# EAGLE design VNH2SP30_dual (EAGLE 7.2.0)
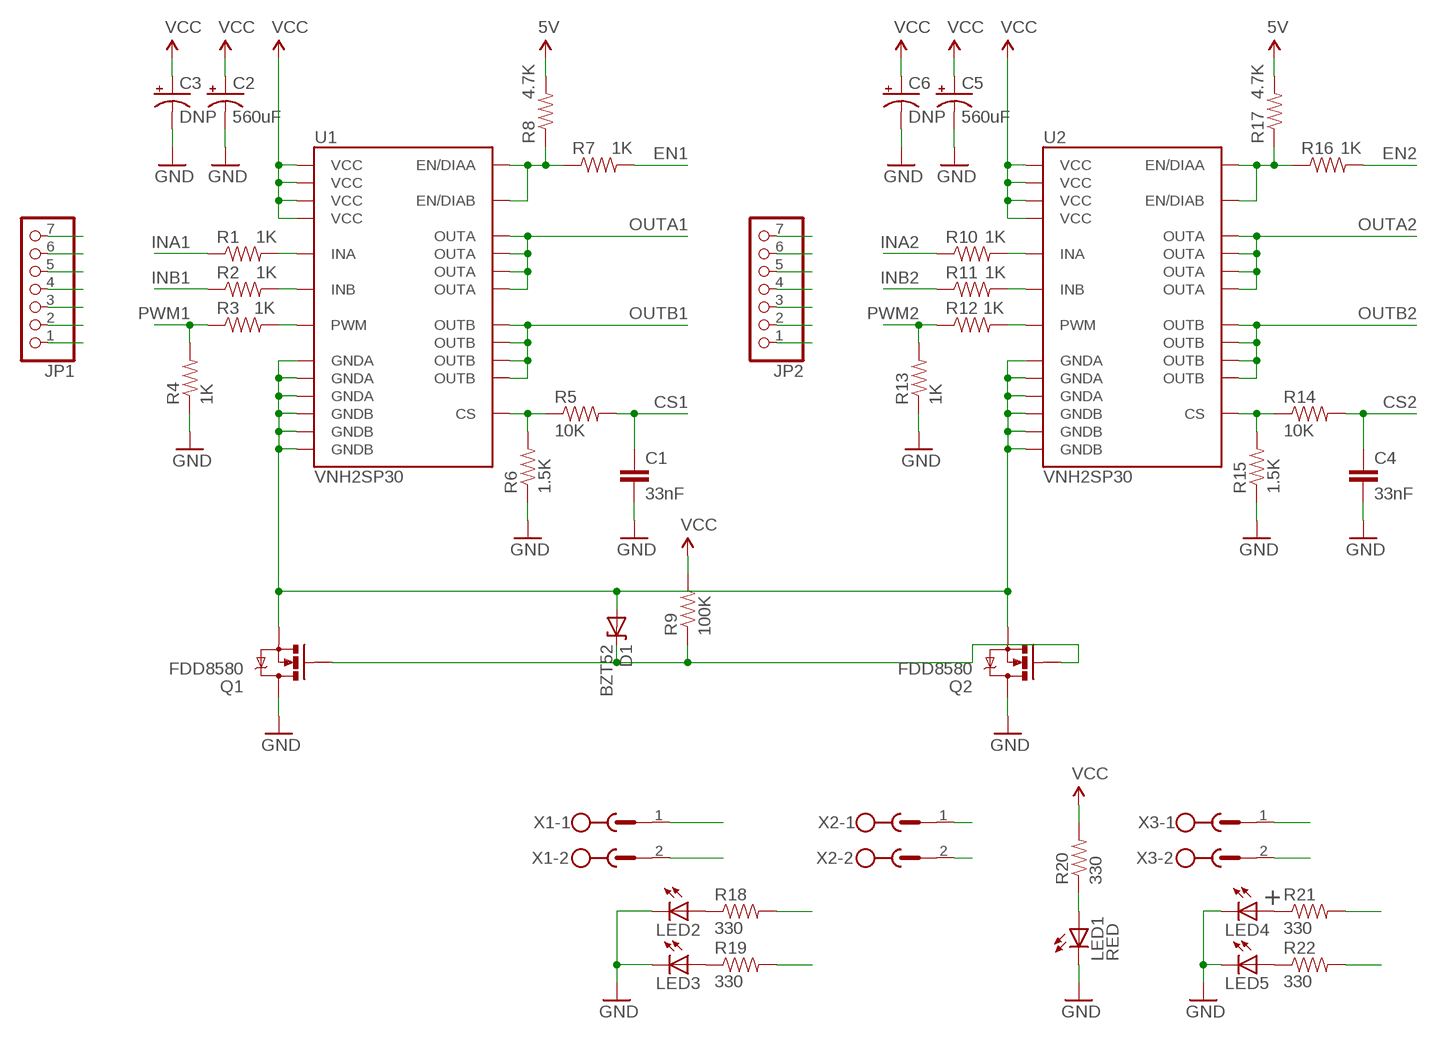
[diagram p0: schematic, sheet 1]

## Parts
C1  33nF  CAP1206  [1206]
C2  560uF  CAP_POLG  [PANASONIC_G]
C3  DNP  CAP_POLPTH4  [CPOL-RADIAL-1000UF-25V]
C4  33nF  CAP1206  [1206]
C5  560uF  CAP_POLG  [PANASONIC_G]
C6  DNP  CAP_POLPTH4  [CPOL-RADIAL-1000UF-25V]
D1  BZT52  DIODE-ZENERSMB  [SMB-DIODE]
JP1  PINHD-1X7  [1X07]
JP2  PINHD-1X7  [1X07]
LED1  RED  LEDCHIPLED_1206  [CHIPLED_1206]
LED2  GREEN  LEDCHIPLED_1206  [CHIPLED_1206]
LED3  GREEN  LEDCHIPLED_1206  [CHIPLED_1206]
LED4  GREEN  LEDCHIPLED_1206  [CHIPLED_1206]
LED5  GREEN  LEDCHIPLED_1206  [CHIPLED_1206]
Q1  FDD8580  MOSFET-NCHANNELFDD8580  [DPAK]
Q2  FDD8580  MOSFET-NCHANNELFDD8580  [DPAK]
R1  1K  RESISTOR1206  [1206]
R2  1K  RESISTOR1206  [1206]
R3  1K  RESISTOR1206  [1206]
R4  1K  RESISTOR1206  [1206]
R5  10K  RESISTOR1206  [1206]
R6  1.5K  RESISTOR1206  [1206]
R7  1K  RESISTOR1206  [1206]
R8  4.7K  RESISTOR1206  [1206]
R9  100K  RESISTOR1206  [1206]
R10  1K  RESISTOR1206  [1206]
R11  1K  RESISTOR1206  [1206]
R12  1K  RESISTOR1206  [1206]
R13  1K  RESISTOR1206  [1206]
R14  10K  RESISTOR1206  [1206]
R15  1.5K  RESISTOR1206  [1206]
R16  1K  RESISTOR1206  [1206]
R17  4.7K  RESISTOR1206  [1206]
R18  330  RESISTOR1206  [1206]
R19  330  RESISTOR1206  [1206]
R20  330  RESISTOR1206  [1206]
R21  330  RESISTOR1206  [1206]
R22  330  RESISTOR1206  [1206]
U1  VNH2SP30  [VNH2SP30]
U2  VNH2SP30  [VNH2SP30]
X1  MSTBV2  [MSTBV2]
X2  MSTBV2  [MSTBV2]
X3  MSTBV2  [MSTBV2]

## Nets
5V: JP1.7 JP2.7 R8.2 R17.2
CS1: C1.1 JP1.2 R5.2
CS2: C4.1 JP2.2 R14.2
EN1: JP1.6 R7.2
EN2: JP2.6 R16.2
GND: C1.2 C2.- C3.2(-) C4.2 C5.- C6.2(-) JP1.1 JP2.1 LED1.C LED2.C LED3.C LED4.C LED5.C Q1.4(D) Q2.4(D) R4.1 R6.1 R13.1 R15.1 X2.1
INA1: JP1.5 R1.1
INA2: JP2.5 R10.1
INB1: JP1.4 R2.1
INB2: JP2.4 R11.1
N$1: R2.2 U1.11(INB)
N$2: R1.2 U1.5(INA)
N$3: R11.2 U2.11(INB)
N$4: R10.2 U2.5(INA)
N$5: R3.2 U1.8(PWM)
N$6: R12.2 U2.8(PWM)
N$7: R5.1 R6.2 U1.9(CS)
N$8: R14.1 R15.2 U2.9(CS)
N$9: R16.1 R17.1 U2.6(EN/DIAA) U2.10(EN/DIAB)
N$10: D1.A Q1.3(S) Q2.3(S) U1.18(GNDB) U1.19(GNDB) U1.20(GNDB) U1.26(GNDA) U1.27(GNDA) U1.28(GNDA) U2.18(GNDB) U2.19(GNDB) U2.20(GNDB) U2.26(GNDA) U2.27(GNDA) U2.28(GNDA)
N$12: R7.1 R8.1 U1.6(EN/DIAA) U1.10(EN/DIAB)
N$13: D1.C Q1.1(G) Q2.1(G) R9.1
N$18: LED1.A R20.1
N$26: LED2.A R18.1
N$27: LED3.A R19.1
N$28: LED4.A R21.1
N$29: LED5.A R22.1
OUTA1: R18.2 U1.1(OUTA) U1.25(OUTA) U1.30(OUTA) U1.SLUG3(OUTA) X1.1
OUTA2: R22.2 U2.1(OUTA) U2.25(OUTA) U2.30(OUTA) U2.SLUG3(OUTA) X3.1
OUTB1: R19.2 U1.15(OUTB) U1.16(OUTB) U1.21(OUTB) U1.SLUG2(OUTB) X1.2
OUTB2: R21.2 U2.15(OUTB) U2.16(OUTB) U2.21(OUTB) U2.SLUG2(OUTB) X3.2
PWM1: JP1.3 R3.1 R4.2
PWM2: JP2.3 R12.1 R13.2
VCC: C2.+ C3.1(+) C5.+ C6.1(+) R9.2 R20.2 U1.3(VCC) U1.13(VCC) U1.23(VCC) U1.SLUG1(VCC) U2.3(VCC) U2.13(VCC) U2.23(VCC) U2.SLUG1(VCC) X2.2

## Notes on the sheet
- +

## Library data of the parts
C1 C4 = SparkFun:CAP: Capacitor Standard 0603 ceramic capacitor, and 0.1" leaded capacitor.
C2 C3 C5 C6 = SparkFun:CAP_POL: Capacitor Polarized These are standard SMD and PTH capacitors. Normally 10uF, 47uF, and 100uF in electrolytic and tantalum varieties. Always verify the external diameter of the through hole cap, it varies with capacity, voltage, and manufacturer. The EIA devices should be standard.
D1 = SparkFun:DIODE-ZENER: Zener Diode Production Part - 8199 3.4V Zener Voltage
JP1 JP2 = pinhead:PINHD-1X7: PIN HEADER
LED1-LED5 = led:LED: LED OSRAM: - CHIPLED LG R971, LG N971, LY N971, LG Q971, LY Q971, LO R971, LY R971 LH N974, LH R974 LS Q976, LO Q976, LY Q976 LO Q996 - Hyper CHIPLED LW Q18S LB Q993, LB Q99A, LB R99A - SideLED LS A670, LO A670, LY A670, LG A670, LP A670 LB A673, LV A673, LT A673, LW A673 LH A674 LY A675 LS A676, LA A676, LO A676, LY A676, LW A676 LS A679, LY A679, LG A679 - Hyper Micro SIDELED® LS Y876, LA Y876, LO Y876, LY Y876 LT Y87S - SmartLED LW L88C, LW L88S LB L89C, LB L89S, LG L890 LS L89K, LO L89K, LY L89K LS L896, LA L896, LO L896, LY L896 - TOPLED LS T670, LO T670, LY T670, LG T670, LP T670 LSG T670, LSP T670, LSY T670, LOP T670, LYG T670 LG T671, LOG T671, LSG T671 LB T673, LV T673, LT T673, LW T673 LH T674 LS T676, LA T676, LO T676, LY T676, LB T676, LH T676, LSB T676, LW T676 LB T67C, LV T67C, LT T67C, LS T67K, LO T67K, LY T67K, LW E67C LS E67B, LA E67B, LO E67B, LY E67B, LB E67C, LV E67C, LT E67C LW T67C LS T679, LY T679, LG T679 LS T770, LO T770, LY T770, LG T770, LP T770 LB T773, LV T773, LT T773, LW T773 LH T774 LS E675, LA E675, LY E675, LS T675 LS T776, LA T776, LO T776, LY T776, LB T776 LHGB T686 LT T68C, LB T68C - Hyper Mini TOPLED® LB M676 - Mini TOPLED Santana® LG M470 LS M47K, LO M47K, LY M47K Source: http://www.osram.convergy.de LUXEON: - LUMILED® LXK2-PW12-R00, LXK2-PW12-S00, LXK2-PW14-U00, LXK2-PW14-V00 LXK2-PM12-R00, LXK2-PM12-S00, LXK2-PM14-U00 LXK2-PE12-Q00, LXK2-PE12-R00, LXK2-PE12-S00, LXK2-PE14-T00, LXK2-PE14-U00 LXK2-PB12-K00, LXK2-PB12-L00, LXK2-PB12-M00, LXK2-PB14-N00, LXK2-PB14-P00, LXK2-PB14-Q00 LXK2-PR12-L00, LXK2-PR12-M00, LXK2-PR14-Q00, LXK2-PR14-R00 LXK2-PD12-Q00, LXK2-PD12-R00, LXK2-PD12-S00 LXK2-PH12-R00, LXK2-PH12-S00 LXK2-PL12-P00, LXK2-PL12-Q00, LXK2-PL12-R00 Source: www.luxeon.com KINGBRIGHT: KA-3528ASYC Source: www.kingbright.com
Q1 Q2 = SparkFun:MOSFET-NCHANNEL
R1-R22 = SparkFun:RESISTOR: Resistor Basic schematic elements and footprints for 0603, 1206, and PTH 1/10th watt (small) resistors.
U1 U2 = SparkFun:VNH2SP30
X1-X3 = con-phoenix-500:MSTBV2: PHOENIX; OC_FARNELL: unknown; OC_NEWARK: unknown

## Board
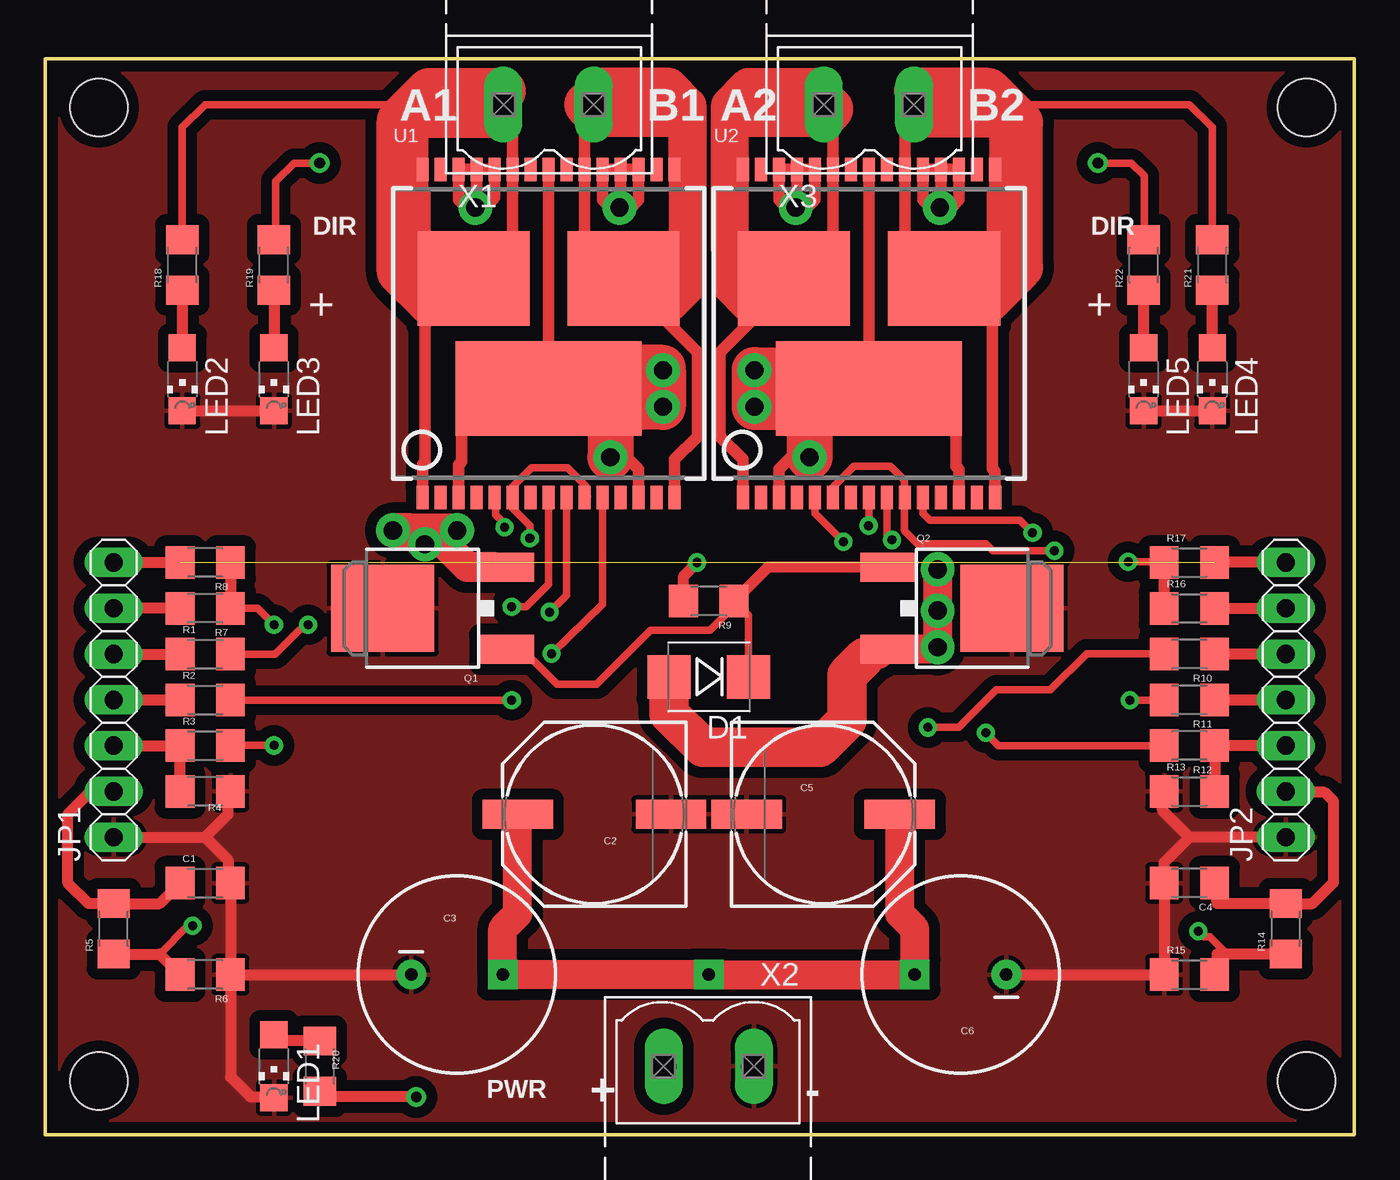
[diagram p1: board, top side]
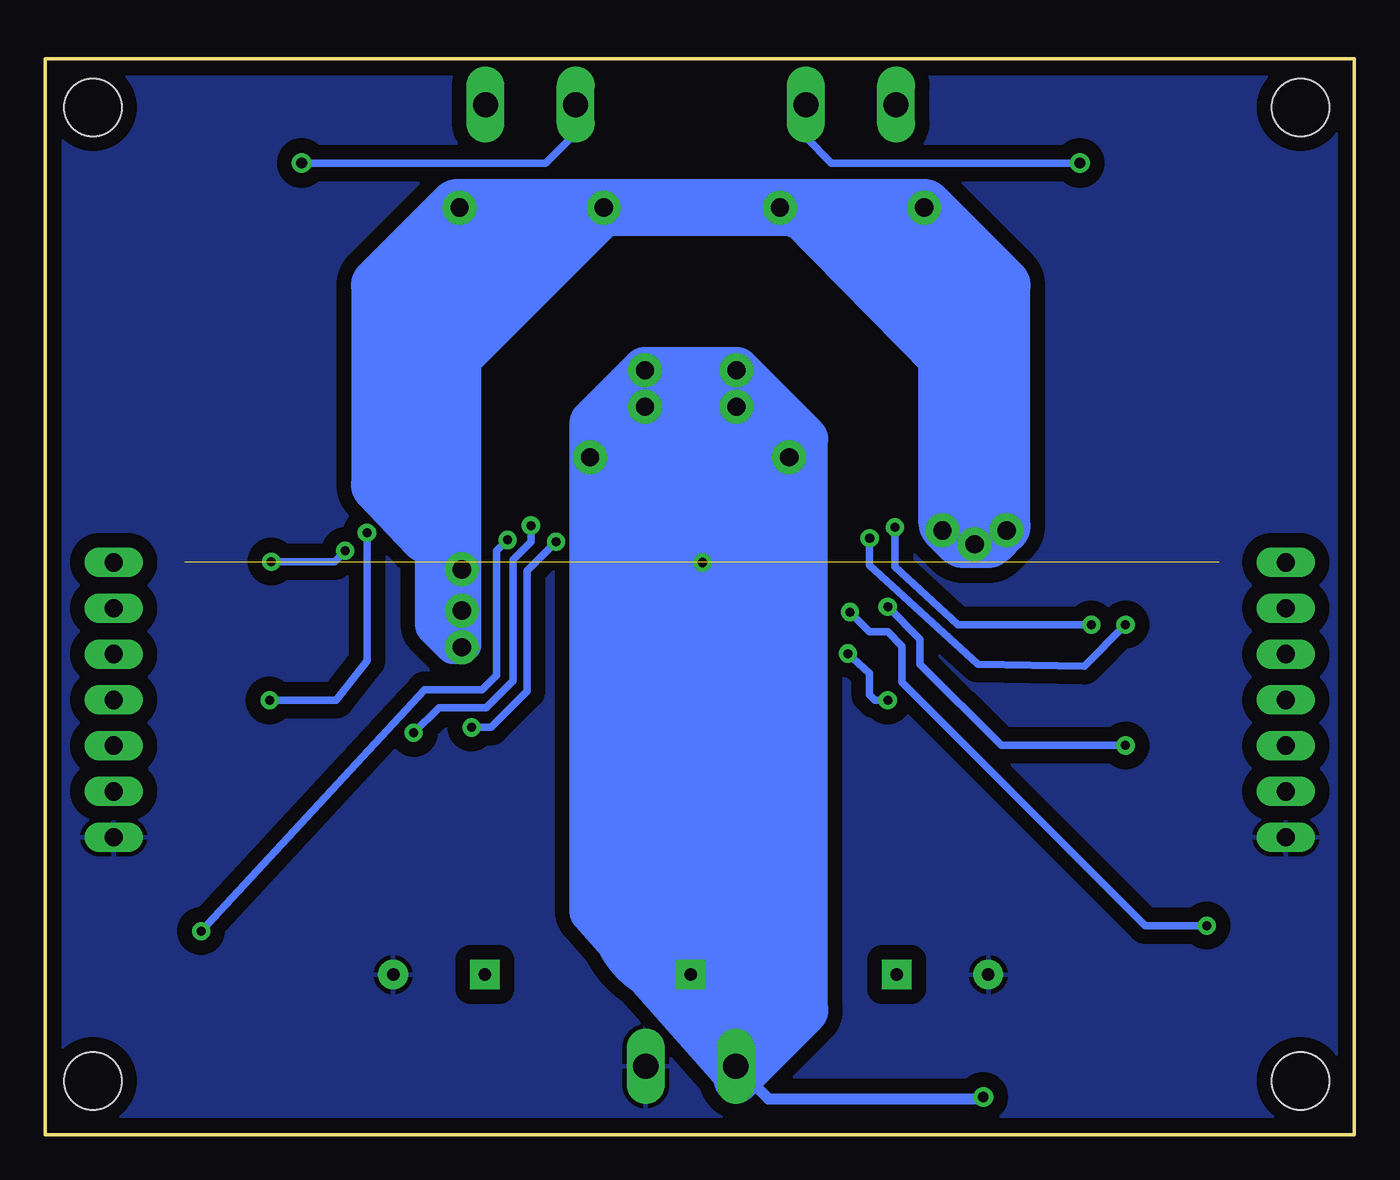
[diagram p2: board, bottom side, seen from below]

Size 72.66 x 59.69 mm. Coordinates in mm from the lower left corner, seen from the top.
Outline: 0,0 72.66,0 72.66,59.69 0,59.69 0,0
Copper layers (1*16): Top 0.035mm / dielectric 1.5mm / Bottom 0.035mm
Design rules "SparkFun *": minimum track width 8mil, minimum drill 20mil, track to track 8mil, track to pad 8mil, pad to pad 8mil, via to via 8mil, smd to smd 8mil, copper to edge 8mil, drill to drill 8mil, minimum pad ring 12mil, minimum via ring 10mil, stop-mask expansion 4mil, vias tented up to drill 40mil, thermal gap 10mil
Holes 3.2 mm at 3,57 3,3 70,3 70,57

### Footprints (pad centres in the part's own frame; a part is rotated, then mirrored left to right if it is on the bottom)
1206 = smd 1.6 x 1.8: 1 -1.4,0; 2 1.4,0
PANASONIC_G = smd 3.9 x 1.6: + 4.25,0; - -4.25,0
CPOL-RADIAL-1000UF-25V = drill 0.7 pad 1.651 square: 1 2.54,0 | drill 0.7 pad 1.651: 2 -2.54,0
SMB-DIODE = smd 2.4 x 2.4: A 2.2,0; C -2.2,0
1X07 = drill 1.016 long: 1 -7.62,0; 2 -5.08,0; 3 -2.54,0; 4 0,0; 5 2.54,0; 6 5.08,0; 7 7.62,0
CHIPLED_1206 = smd 1.5 x 1.5: A 0,-1.75; C 0,1.75
DPAK = smd 1.6 x 3: 1 -2.28,-5.31; 3 2.28,-5.31 | smd 4.826 x 5.715: 4 0,1.588
VNH2SP30 = smd 0.67 x 1.3: 1 -7,-9.1; 2 -6,-9.1; 3 -5,-9.1; 4 -4,-9.1; 5 -3,-9.1; 6 -2,-9.1; 7 -1,-9.1; 8 0,-9.1; 9 1,-9.1; 10 2,-9.1; 11 3,-9.1; 12 4,-9.1; 13 5,-9.1; 14 6,-9.1; 15 7,-9.1; 16 7,9.1; 17 6,9.1; 18 5,9.1; 19 4,9.1; 20 3,9.1; 21 2,9.1; 22 1,9.1; 23 0,9.1; 24 -1,9.1; 25 -2,9.1; 26 -3,9.1; 27 -4,9.1; 28 -5,9.1; 29 -6,9.1; 30 -7,9.1 | smd 10.3 x 5.25: SLUG1 0,-3.05 | smd 6.23 x 5.25: SLUG2 4.165,3.05; SLUG3 -4.165,3.05
MSTBV2 = drill 1.397 long: 1 -2.5,0; 2 2.5,0

### Placement (x,y rotation side)
C1  8.89,13.97 0 top
C2  30.48,17.78 180 top
C3  22.86,8.89 0 top
C4  63.5,13.97 180 top
C5  43.18,17.78 0 top
C6  50.8,8.89 180 top
D1  36.83,25.4 180 top
JP1  3.81,24.13 90 top
JP2  68.85,24.13 90 top
LED1  12.7,3.81 180 top
LED2  7.62,41.91 180 top
LED3  12.7,41.91 180 top
LED4  64.77,41.91 180 top
LED5  60.96,41.91 180 top
Q1  20.32,29.21 90 top
Q2  52.07,29.21 270 top
R1  8.89,26.67 0 top
R2  8.89,24.13 0 top
R3  8.89,21.59 0 top
R4  8.89,19.05 180 top
R5  3.81,11.43 90 top
R6  8.89,8.89 180 top
R7  8.89,29.21 180 top
R8  8.89,31.75 180 top
R9  36.83,29.61 180 top
R10  63.5,26.67 180 top
R11  63.5,24.13 180 top
R12  63.5,21.59 180 top
R13  63.5,19.05 0 top
R14  68.85,11.43 90 top
R15  63.5,8.89 0 top
R16  63.5,29.21 0 top
R17  63.5,31.75 0 top
R18  7.62,48.26 90 top
R19  12.7,48.26 90 top
R20  15.24,3.81 270 top
R21  64.77,48.26 90 top
R22  60.96,48.26 90 top
U1  27.94,44.45 0 top
U2  45.72,44.45 0 top
X1  27.94,57.15 0 top
X2  36.83,3.81 180 top
X3  45.72,57.15 0 top

### Tracks (layer width: path | path; a pad name or v marks a point on that pad's centre or on a via)
5V  (1 unrouted)
  Top 0.61: JP2.7 R17.2 | JP1.7 R8.2
CS1
  Top 0.61: C1.1 6.35,12.83 R5.2 2.41,12.83 1.27,13.97 1.27,17.78 2.54,19.05 JP1.2
CS2
  Top 0.61: C4.1 65.04,12.83 R14.2 70.33,12.83 71.5,14 71.5,18.5 71,19 68.9,19 JP2.2
EN1
  Top 0.61: R7.2 JP1.6
EN2
  Top 0.61: R16.2 JP2.6
GND
  Top 0.61: LED2.C LED3.C | LED5.C LED4.C | JP1.1 8.89,16.51 | 8.89,16.51 10.16,17.78 10.16,18.92 R4.1 | 8.89,16.51 10.16,15.24 10.16,14.1 C1.2 R6.1 | R6.1 10.29,3.21 11.4,2.1 12.66,2.1 LED1.C | R6.1 C3.2 | C6.2 R15.1 C4.2 62.1,15.12 63.49,16.51 | JP2.1 63.49,16.51 | 63.49,16.51 62,18 62,18.95 R13.1
  pour Top (isolate 0.61): 0,0 0.1,59.69 72.66,59.69 72.66,0
  pour Bottom (isolate 0.813): 72.66,0 0,0 0,59.79 72.76,59.69
INA1
  Top 0.61: JP1.5 R1.1
INA2
  Top 0.61: JP2.5 R10.1
INB1
  Top 0.61: JP1.4 R2.1
INB2
  Top 0.61: R11.1 JP2.4
N$1  (via drill 0.5 pad 0.61)
  Top 0.406: U1.11 30.94,29.44 v28.1,26.7 | R2.2 10.32,24.1 v25.9,24.1
  Bottom 0.406: v28.1,26.7 26.9,25.6 26.9,24.4 26.6,24.1 v25.9,24.1
N$2  (via drill 0.5 pad 0.61)
  Top 0.406: R1.2 12.77,26.67 14.1,28 v14.6,28.3 | v25.5,33.7 25.5,33.9 25,34.4 25,35.29 U1.5
  Bottom 0.406: v14.6,28.3 22,28.3 25.5,31.5 v25.5,33.7
N$3  (via drill 0.5 pad 0.81)
  Top 0.406: U2.11 48.72,34.48 49.1,34.1 54.1,34.1 v54.8,33.4 | v60.2,24.1 62.07,24.1 R11.2
  Bottom 0.406: v54.8,33.4 54.8,26.3 56.5,24.1 v60.2,24.1
N$4  (via drill 0.5 pad 0.61)
  Top 0.406: U2.5 42.72,34.48 v44.3,32.9 | v49,22.6 50.7,22.6 52.8,24.7 55.8,24.7 57.8,26.7 62.07,26.7 R10.2
  Bottom 0.406: v44.3,32.9 45.9,31.3 45.9,24.6 47.9,22.6 v49,22.6
N$5  (via drill 0.5 pad 0.61)
  Top 0.406: U1.8 27.94,30.54 26.7,29.3 v25.9,29.3 | v12.7,21.6 R3.2
  Bottom 0.406: v12.7,21.6 19.6,21.6 24.1,26.1 24.1,27.5 v25.9,29.3
N$6  (via drill 0.5 pad 0.61)
  Top 0.406: U2.8 45.72,34.22 45.7,34.2 v45.7,33.8 | R12.2 52.91,21.59 v52.2,22.3
  Bottom 0.406: v45.7,33.8 45.7,32.9 46.7,31.9 46.7,25.2 48.2,23.7 50.8,23.7 v52.2,22.3
N$7  (via drill 0.5 pad 0.61)
  Top 0.406: U1.9 28.94,29.94 v28,29 | v8.2,11.6 7.92,11.6 6.35,10.03
  Top 0.61: R5.1 6.35,10.03 R6.2
  Bottom 0.406: v28,29 26.9,27.9 25.9,27.9 25.1,27.1 25.1,25.1 11.6,11.6 v8.2,11.6
N$8  (via drill 0.5 pad 0.61)
  Top 0.406: U2.9 46.72,33.28 v47,33 | v64,11.3 64.3,11 64.63,11 65.6,10.03
  Top 0.61: R14.1 65.6,10.03 65.04,10.03 R15.2
  Bottom 0.406: v47,33 47.6,32.4 47.6,25.5 48.4,24.7 51.6,24.7 v64,11.3
N$9  (via drill 0.5 pad 0.81)
  Top 0.406: v56,32.4 52.6,32.4 52.2,32.8 48.4,32.8 47.7,33.5 47.7,35.33 U2.10 47.7,35.37 47.7,36.3 46.9,37.1 44.9,37.1 43.72,35.92 U2.6 | v60.1,31.8 62.05,31.8 R17.1
  Top 0.61: R16.1 R17.1
  Bottom 0.406: v60.1,31.8 56.6,31.8 v56,32.4
N$10  (via drill 1.02 pad 1.88)
  Top 0.645: U2.19 U2.18 50.72,51.86 50.29,51.44 | U2.19 U2.20 48.72,51.86 49.15,51.44 | U1.27 U1.28 22.94,52.07 22.94,51.86 23.37,51.44 | U1.19 U1.20 30.94,51.86 31.37,51.44 | U1.19 U1.18 32.94,51.86 32.51,51.44 | U2.27 U2.28 40.72,51.86 41.15,51.44 | U1.19 31.94,51.5 v31.88,51.44 | U1.27 23.94,51.5 v23.88,51.44 | U2.19 49.72,51.5 v49.66,51.44 | U1.27 U1.26 24.94,51.99 24.38,51.44 | U2.27 U2.26 42.72,51.86 | 41.72,51.5 U2.27 | v41.66,51.44 41.72,51.5 | 41.72,51.5 42.35,51.5 42.67,51.82
  Top 1.27: 45.5,26.5 46.33,26.5 Q2.3
  Top 1.6: 24.9,31.49 Q1.3 | Q2.3 49.41,26.93 v49.53,27.05 v49.53,31.37
  Top 1.676: 24.9,31.49 23.44,31.49 21.4,33.53
  Top 1.88: v22.86,33.53 21.4,33.53 v19.3,33.53 20.32,33.53 v21.08,32.77
  Top 2.184: D1.A 34.63,23.37 36.5,21.5 43,21.5 44.5,23 44.5,25.5 45.5,26.5
  Bottom 0.254: 21.21,43.56 21.21,38.48 21.59,38.1 22.48,38.1 22.61,43.18
  Bottom 0.645: 42.16,51.18 42.16,51.05 | 42.16,51.31 41.78,51.31 v41.66,51.44
  Bottom 1.6: 51.82,39.88 51.82,35.81 | v49.53,29.08 51.05,29.08 51.18,29.21 | v49.53,31.37 49.66,31.37 50.04,31.75 | 51.82,39.88 51.82,44.2 | 51.82,39.88 50.55,39.88 50.04,43.18
  Bottom 1.88: v19.3,33.53 19.56,33.78 | v49.53,31.37 49.4,31.37 49.4,27.18 v49.53,27.05 50.04,27.05 51.18,28.19 51.18,29.21 51.18,32.26
  Bottom 3.175: 30.86,51.31 30.61,51.31 22.61,43.18 22.61,33.91 21.72,33.02 20.32,33.02 19.56,33.78 19.56,47.12 v23.88,51.44 v31.88,51.44 v41.66,51.44 v49.66,51.44 49.78,51.44 54.1,47.12 54.1,36.07 51.44,33.27 | 50.04,31.5 50.04,31.75 50.04,43.18 42.16,51.05 41.91,51.31 | 42.16,51.31 42.16,51.18
  Bottom 5.08: 21.21,43.56 27.43,49.78 | 51.82,44.2 46.99,49.02
N$12  (via drill 0.5 pad 0.61)
  Top 0.406: 30,35.41 30,36 29,37 27,37 25.94,35.94 U1.6 25.94,34.76 26.9,33.8 v26.9,33.1 | R7.1 11.79,29.21 v12.7,28.3
  Top 0.61: R8.1 R7.1 | 30,35.41 U1.10
  Bottom 0.406: v26.9,33.1 26.9,31.6 20.9,26.1 15,26 v12.7,28.3
N$13
  Top 0.406: Q1.1 26.47,26.93 28.4,25 30.6,25 33.6,28 36.9,28 37.9,29 37.9,29.28 R9.1 39.03,28.81 D1.C
  Top 0.61: Q2.1 40.11,31.49 R9.1
N$18
  Top 0.61: R20.1 13.05,5.21 LED1.A
N$26
  Top 0.61: R18.1 LED2.A
N$27
  Top 0.61: R19.1 LED3.A
N$28
  Top 0.61: LED4.A R21.1
N$29
  Top 0.61: LED5.A R22.1
OUTA1
  Top 0.406: X1.1 24.13,57.15 | X1.1 25.94,57.15 25.94,56.61 | R18.2 7.62,55.88 8.89,57.15 X1.1
  Top 0.61: 21.08,46.48 21.59,46.99 23.27,46.99 U1.SLUG3 25.94,49.66
  Top 0.645: U1.1 20.94,37.2 21.08,37.34 21.08,45.72 21.08,46.48 | 25.94,49.66 U1.25 25.94,56.61 | 21.59,46.99 21.08,47.5 21.08,52.2 20.94,52.34 U1.30 20.94,56.66 20.83,56.77 | 20.95,46.35 21.34,46.23 | 20.83,46.1 21.21,46.1 | 20.95,55.75 21.08,55.88 20.45,55.88 20.32,56.01 | 20.19,56.01 19.56,56.01 19.68,56.26
  Top 0.762: 21.59,46.99 20.95,46.35 | 20.83,46.1 20.32,46.61 20.32,49.15 20.7,49.15
  Top 1.143: 20.19,56.01 20.32,56.01 | 20.83,46.1 20.83,45.97 21.08,45.72
  Top 1.397: 20.32,56.01 25.4,56.01
  Top 2.54: 21.34,46.23 19.68,47.88 19.68,56.26 21.34,57.91 25.4,57.91
  Top 3.81: 23.52,47.75 U1.SLUG3
OUTA2  (via drill 0.6)
  Top 0.254: 37.85,57.15 38.35,56.64 | 43.56,56.9 43.31,57.15 | 37.85,49.02 37.97,48.39 40.21,46.15
  Top 0.406: 43.72,56.23 43.22,56.23 X3.1 | v58.42,53.91 60.29,53.91 61,53.2 61,49.7 R22.2
  Top 0.645: U2.1 38.72,37.48 37.47,38.73 37.47,43.41 40.21,46.15 U2.SLUG3 | U2.SLUG3 38.86,49.81 38.86,49.66 38.72,49.8 U2.30 38.72,55.87 38.73,55.88 | U2.SLUG3 43.72,49.66 U2.25 43.72,56.23 43.43,56.52
  Top 0.671: 43.56,56.9 43.69,56.77
  Top 1.143: 37.85,49.02 39.24,47.37
  Top 1.168: 38.1,47.5 38.35,47.24 37.85,47.12
  Top 1.778: 43.31,58.29 38.99,58.29 37.85,57.15 37.85,49.02 37.85,47.12 38.99,45.97
  Top 2.54: 38.35,56.64 43.31,56.64 43.56,56.9
  Bottom 0.406: v58.42,53.91 44.89,53.91 43.2,55.6 43.2,57.13 X3.1
OUTB1  (via drill 0.6)
  Top 0.254: 35.31,56.64 35.81,57.15
  Top 0.406: 30.29,56.96 31.75,56.96 31.75,57.15 X1.2 | v15.24,53.91 13.81,53.91 12.8,52.9 12.8,49.76 R19.2
  Top 0.61: 32.82,46.79 U1.SLUG2 29.94,49.66
  Top 0.645: U1.15 34.94,37.48 36.2,38.73 36.2,43.41 32.82,46.79 34.8,48.77 34.8,49.66 34.94,49.8 U1.16 | 29.94,49.66 U1.21 29.94,56.61 30.29,56.96
  Top 0.671: U1.16 34.94,56.5 34.29,57.15
  Top 1.143: 35.81,49.02 34.67,47.62
  Top 1.168: 35.81,47.12 35.75,47.05 35.31,47.24 35.18,47.24 | 35.18,47.24 35.05,47.24 | 35.18,47.24 35.31,47.37
  Top 1.778: 30.35,58.29 34.67,58.29 35.81,57.15 35.81,49.02 35.81,47.12 | 35.75,47.05 34.67,45.97
  Top 2.54: 35.31,56.64 30.61,56.64 30.29,56.96 30.1,57.15
  Bottom 0.406: v15.24,53.91 29.01,53.91 30.5,55.4 30.5,57.09 X1.2
OUTB2
  Top 0.254: 52.58,46.48 52.58,46.99 52.32,47.24 | 52.32,47.24 52.07,47.5 | 52.32,47.24 52.58,47.5 | 52.32,47.24 52.07,46.99
  Top 0.406: X3.2 48.26,57.15 | 50.8,57.15 48.26,57.15 | 48.26,57.15 48.26,56.64 | R21.2 64.77,55.88 63.5,57.15 53.34,57.15
  Top 0.61: 53.34,57.15 53.21,57.02
  Top 0.645: U2.15 52.72,36.81 52.58,36.96 52.58,45.72 52.32,45.97 | U2.SLUG2 47.72,49.66 U2.21 47.72,56.61 | 52.58,47.5 52.58,52.2 52.72,52.34 U2.16 52.72,56.37 52.32,56.26
  Top 0.762: 53.59,49.15 53.09,49.15 53.09,48.26 | 53.09,48.26 53.09,48.01 | U2.SLUG2 51.56,47.5 52.07,46.99 | 52.58,47.5 52.58,47.75 53.09,48.26 | 52.2,46.23 52.58,46.48
  Top 1.88: 52.32,45.97 52.2,46.23 | 52.32,56.26 48.26,56.26 48.26,56.64
  Top 2.54: 52.2,46.23 54.1,48.13 54.1,56.13 53.21,57.02 52.32,57.91 48.39,57.91
  Top 3.81: U2.SLUG2
PWM1
  Top 0.61: JP1.3 R3.1 R4.2
PWM2
  Top 0.61: JP2.3 R12.1 R13.2
VCC  (via drill 0.51, 0.6, 0.7 pad 1.65, 1.02 pad 1.88)
  Top 0.61: 33.02,40.39 32.94,40.31 | 23.11,39.62 24.13,40.64 27.94,40.64 | 30.48,42.55 31.43,41.59 32.77,40.26 | 50.55,39.62 49.53,40.64 45.72,40.64 | v20.6,2.1 15.55,2.1 R20.2 | R9.2 35.43,31 v36.18,31.75
  Top 0.645: U1.3 22.94,37.16 23.11,37.34 23.11,39.62 | U2.13 50.72,36.91 50.55,37.08 50.55,39.62 | 27.94,40.64 U1.23 | 45.72,40.64 U2.SLUG1 U2.23 | v34.29,42.42 34.29,42.55 | U1.13 32.94,36.91 32.26,37.59 v31.37,37.59 | U2.3 40.72,36.91 41.4,37.59 41.91,37.59 42.42,38.1
  Top 1.6: C2.+ 26.23,12.26 25.4,11.43 C3.1 v36.83,8.89 C6.1 48.26,11.43 47.43,12.26 C5.+
  Top 2.54: v34.29,40.39 34.29,41.91 | v34.29,40.39 33.02,40.39 28.95,40.39 U1.SLUG1 | v34.29,42.42 v34.29,40.39 | 34.29,42.55 30.48,42.55 29.84,42.55 27.94,40.64 | 41.91,42.42 v39.37,42.42 v39.37,40.39 41.91,40.39 | 41.91,42.42 43.94,42.42 45.72,40.64 | v31.37,37.59 31.37,41.53 31.43,41.59 | v42.42,37.59 42.42,38.1 42.42,41.91 41.91,42.42
  Bottom 0.254: 34.29,40.64 v34.29,40.39 34.54,40.39 | 30.48,6.86 30.48,6.99
  Bottom 0.406: X2.2 34.29,3.81
  Bottom 0.508: 31.75,10.03 31.88,10.03 | 31.75,10.03 31.62,10.03 | 30.48,6.99 30.48,8.76 31.75,10.03 | 36.83,10.16 v36.83,8.89
  Bottom 0.61: v20.6,2.1 20.7,2 32.52,2 X2.2
  Bottom 0.645: v36.18,31.75 36.58,31.75 36.83,32
  Bottom 1.6: 34.29,3.05 34.29,3.81 34.29,7.62
  Bottom 11.43: 36.83,12.7 36.83,32 36.83,36.83
  Bottom 2.54: 30.48,6.86 34.29,3.05 34.39,3.49 42.28,12.41 42.28,39.41 | 34.54,40.39 34.04,40.39 | 30.48,6.99 30.48,38.61 v34.29,42.42 v39.37,42.42 42.25,39.53
  Bottom 6.452: 36.83,10.16 36.83,12.7
  Bottom 6.858: 34.29,7.62 36.83,10.16

### Text on the board
tPlace: A1 | A2 | B1 | B2 | DIR | DIR | + | + | PWR | + | -